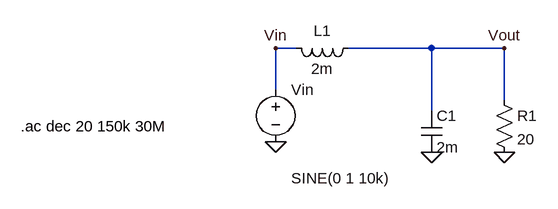
[diagram p0: schematic filter1.asc]
filter1.asc, the LTspice schematic file:
Version 4
SHEET 1 880 680
WIRE 80 48 48 48
WIRE 288 48 160 48
WIRE 400 48 288 48
WIRE 48 112 48 48
WIRE 400 128 400 48
WIRE 288 144 288 48
FLAG 288 208 0
FLAG 400 208 0
FLAG 48 192 0
FLAG 400 48 Vout
FLAG 48 48 Vin
SYMBOL voltage 48 96 R0
WINDOW 3 24 152 Left 2
WINDOW 39 0 0 Left 2
SYMATTR InstName Vin
SYMATTR Value SINE(0 1 10k)
SYMATTR Value2 AC 11 0
SYMBOL res 384 112 R0
SYMATTR InstName R1
SYMATTR Value 20
SYMBOL cap 272 144 R0
SYMATTR InstName C1
SYMATTR Value 2m
SYMBOL ind 176 32 R90
WINDOW 0 5 56 VBottom 2
WINDOW 3 32 56 VTop 2
SYMATTR InstName L1
SYMATTR Value 2m
TEXT -344 168 Left 2 !.ac dec 20 150k 30M

The netlist it stands for:
* filter1.asc
Vin Vin 0 SINE(0 1 10k) AC 11 0
R1 Vout 0 20
C1 Vout 0 2m
L1 Vout Vin 2m
.ac dec 20 150k 30M
.backanno
.end